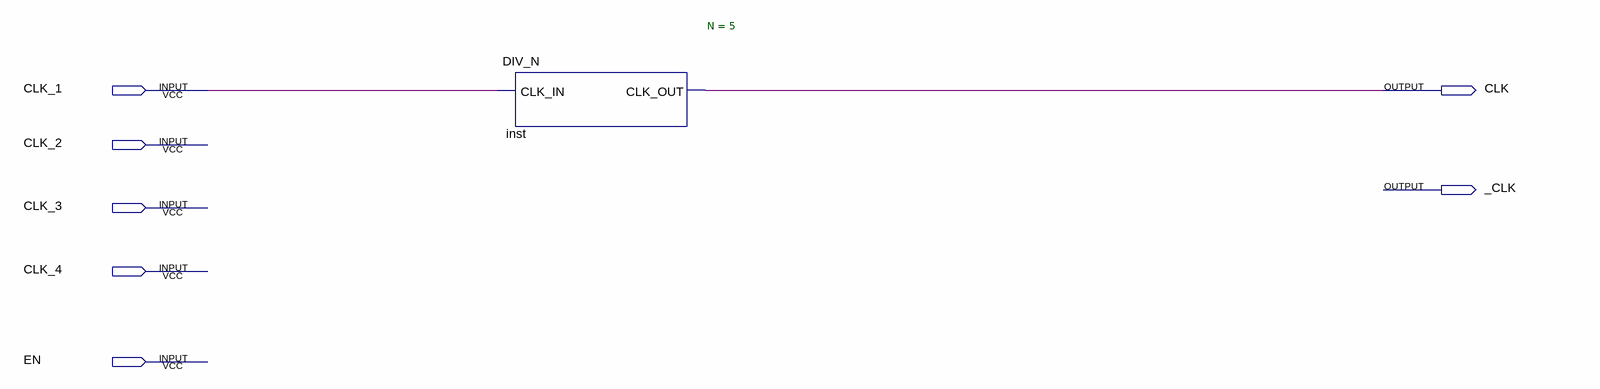
[diagram p0: schematic sheet]
// Quartus schematic ClockUnit.bdf as structural Verilog: 1 symbols, 7 pins
module ClockUnit (
  input  CLK_1,
  input  CLK_2,
  input  CLK_3,
  input  CLK_4,
  input  EN,
  output CLK,
  output _CLK
);

  DIV_N #(.N(5)) inst (.CLK_IN(CLK_1), .CLK_OUT(CLK));
endmodule
